# Altium schematic sheet 比较器.SchDoc
size A4
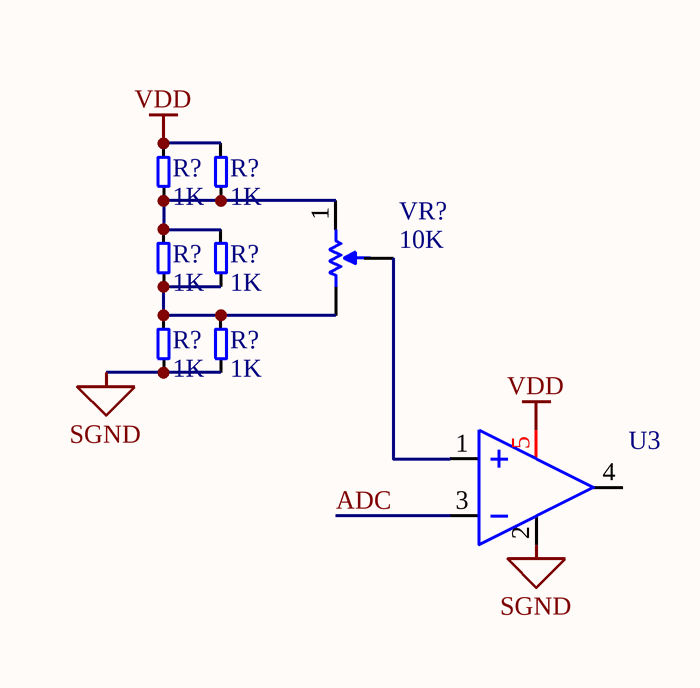
[diagram p0: 比较器.SchDoc]

## Parts
(Parts that share a designator on the sheet are numbered #1, #2 ... from top to bottom, then left to right.)
R?#1  1K  [0603]
R?#2  1K  [0603]
R?#3  1K  [0603]
R?#4  1K  [0603]
R?#5  1K  [0603]
R?#6  1K  [0603]
U3  LM321  [SOT-23-5L]  (value not drawn)
VR?  10K  [R16P5.083PIN]

## Nets
SGND: R?#5.1 R?#6.1 U3.2(V-)
VDD: R?#1.2 R?#2.2 U3.5(V+)
ADC: U3.3(IN1-)
NetR?#1_1: R?#1.1 R?#2.1 R?#3.2 R?#4.2 VR?.1
NetR?#3_1: R?#3.1 R?#4.1 R?#5.2 R?#6.2 VR?.3
NetU3_1: U3.1(IN1+) VR?.2

Not connected (* = marked no-connect by the designer): U3 4(OUT1)

## Library data of the parts
R?#1-R?#6 = Res1: 电阻; Specifications: ±1%; Published: 8-Jun-2000; LatestRevisionDate: 17-Jul-2002; LatestRevisionNote: Re-released for DXP Platform.; PackageReference: AXIAL-0.3; Publisher: Altium Limited; Value: 1K
U3 = LM321: 运放; Value: LM321; specifications: LM321
VR? = Res Adj: 可调电阻; Set Position: 0.5; Specifications: ±20%; Published: 8-Jun-2000; LatestRevisionDate: 17-Jul-2002; PackageReference: AXIAL-0.7; Publisher: Altium Limited; Value: 10K; LatestRevisionNote: 电位器正对你方正，顺时针旋转，12脚之间电阻增加